# Altium schematic sheet STEPPER_MOTOR.SchDoc
size A4
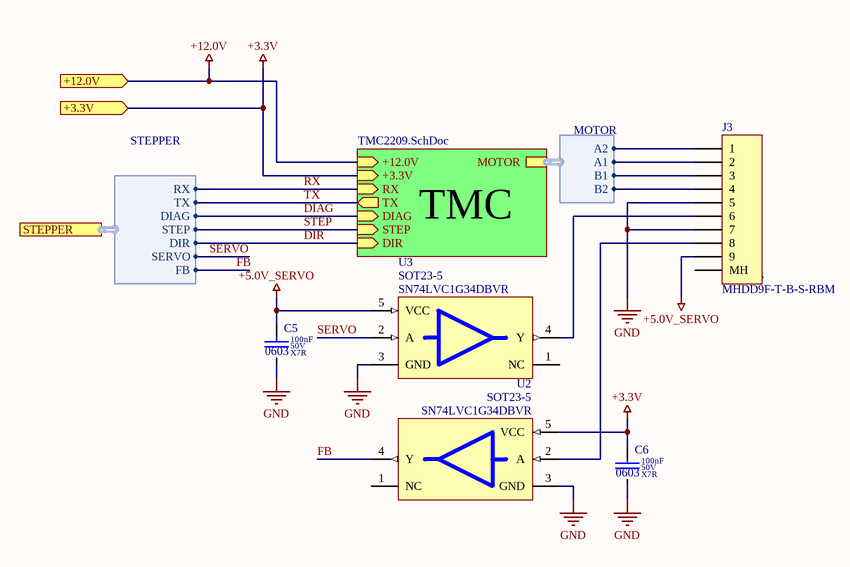
[diagram p0: STEPPER_MOTOR.SchDoc]

## Parts
C5  value 100nF  Dielectric: X7R  Voltage: 50V  SCH_Footprint: 0603  [C_0603_1608]  (hidden comment: Ceramic X7R)
C6  value 100nF  Dielectric: X7R  Voltage: 50V  SCH_Footprint: 0603  [C_0603_1608]  (hidden comment: Ceramic X7R)
J3  value MHDD9F-T-B-S-RBM  [J_DSUB_MHDD9F-T-B-S-RBM]  (hidden comment: DSUB 9 Pin)
U2  value SN74LVC1G34DBVR  SCH_Footprint: SOT23-5  [SOT23-5_SC74A_SOT753_M]  (hidden comment: Single Buffer Gate)
U3  value SN74LVC1G34DBVR  SCH_Footprint: SOT23-5  [SOT23-5_SC74A_SOT753_M]  (hidden comment: Single Buffer Gate)

## Sub-sheets
Designator = TMC2209.SchDoc: TX (out), +3.3V (in), RX (in), DIR (in), STEP (in), +12.0V (in), DIAG (in), MOTOR (harness MOTOR)

## Ports
+3.3V (in), +12.0V (in), STEPPER (harness STEPPER)

## Harnesses
MOTOR: A2, A1, B1, B2
STEPPER: RX, TX, DIAG, STEP, DIR, SERVO, FB

## Nets
+3.3V: C6.1 U2.5(VCC) ; port +3.3V, sheet Designator/+3.3V
+5.0V_SERVO: C5.1 J3.9 U3.5(VCC)
+12.0V: port +12.0V, sheet Designator/+12.0V
GND: C5.2 C6.2 J3.5 J3.7 U2.3(GND) U3.3(GND)
DIAG: sheet Designator/DIAG, port STEPPER.DIAG
DIR: sheet Designator/DIR, port STEPPER.DIR
FB: U2.4(Y) ; port STEPPER.FB
RX: sheet Designator/RX, port STEPPER.RX
SERVO: U3.2(A) ; port STEPPER.SERVO
STEP: sheet Designator/STEP, port STEPPER.STEP
TX: sheet Designator/TX, port STEPPER.TX
NetJ3_1: J3.1 ; sheet Designator/MOTOR.A2
NetJ3_2: J3.2 ; sheet Designator/MOTOR.A1
NetJ3_3: J3.3 ; sheet Designator/MOTOR.B1
NetJ3_4: J3.4 ; sheet Designator/MOTOR.B2
NetJ3_6: J3.6 U3.4(Y)
NetJ3_8: J3.8 U2.2(A)

Not connected (* = marked no-connect by the designer): J3 MH; U2 1(NC); U3 1(NC)

## Notes on the sheet
- TMC

## Library data of the parts
C5 C6 = C_100nF_50V_X7R_0603_5: Capacitor; Manufacturer: Samsung; Manufacturer Part Number: CL10B104JB8NNNC; Tolerance (%): 5; Part Number: C_100nF_50V_X7R_0603_5; HelpURL: http://www.tme.eu/pl/Document/4a42202b32dab16128fe107dd69598cc/samsung-chip-cap.pdf; Supplier 1: TME; Supplier Part Number 1: CL10B104JB8NNNC; Supplier 2: RS Components; Supplier Part Number 2: 7665455; Supplier 3: Farnell; Supplier 4: Mouser; Supplier 5: Digi-Key; Supplier Part Number 5: 1276-1033-1-ND; Supplier 6: LCSC; Supplier Part Number 6: C24452
J3 = J_DSUB: Header, 9-Pin; Manufacturer: MH Connectors; SCH_Footprint: J_DSUB; Part Number: J_DSUB; HelpURL: https://www.tme.eu/Document/d24efe21bdaa08410b5ca50a678e1de1/MHDDXX-F-T-B-S-RBM.PDF; Manufacturer Part Number: MHDD9F-T-B-S-RBM; Supplier 1: TME; Supplier Part Number 1: MHDD9F-T-B-S-RBM; Supplier 2: RS Components; Supplier 3: Farnell; Supplier Part Number 3: 2533067; Supplier 4: Mouser; Supplier 5: Digi-Key; Supplier 6: LCSC
U2 U3 = U_SN74LVC1G34DBVR: Manufacturer: Texas Instruments; Part Number: U_SN74LVC1G34DBVR; HelpURL: http://www.ti.com/lit/ds/symlink/sn74lvc1g34.pdf; Manufacturer Part Number: SN74LVC1G34DBVR; Supplier 1: TME; Supplier Part Number 1: SN74LVC1G34DBVR; Supplier 2: RS Components; Supplier Part Number 2: 662-8774; Supplier 3: Farnell; Supplier Part Number 3: 2134094; Supplier 4: Mouser; Supplier Part Number 4: 595-SN74LVC1G34DBVR; Supplier 5: Digi-Key; Supplier Part Number 5: 296-17893-1-ND; Supplier 6: LCSC